# Altium schematic sheet analog_adc.SchDoc
size A3
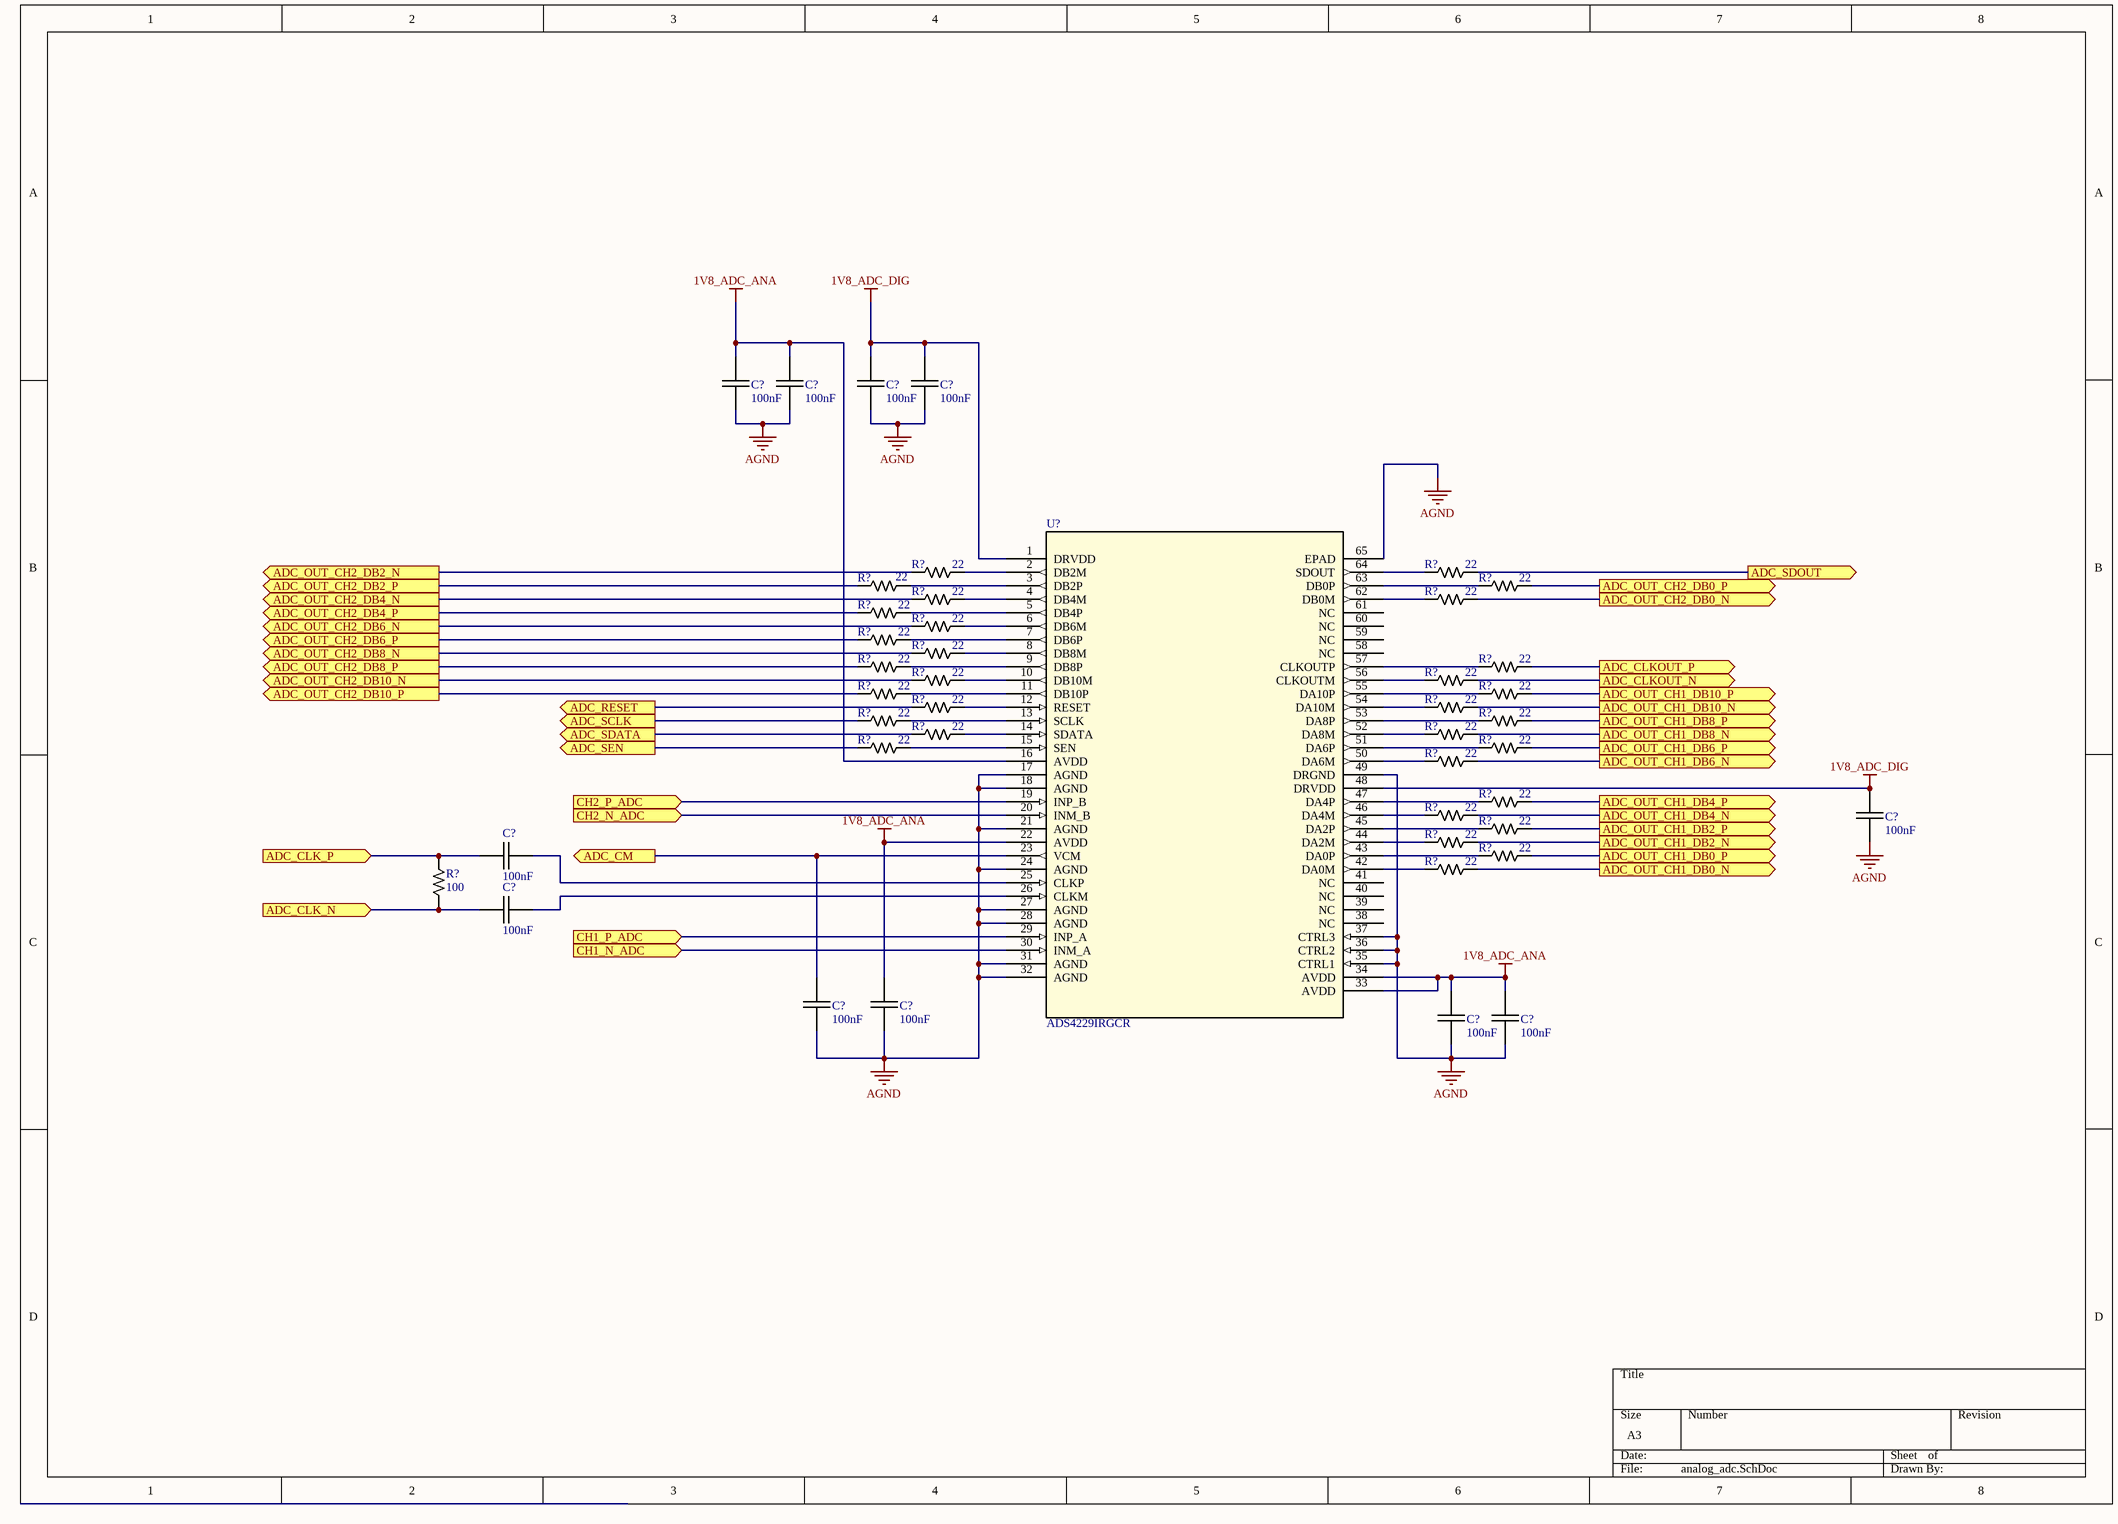
[diagram p0: analog_adc.SchDoc]

## Parts
(Parts that share a designator on the sheet are numbered #1, #2 ... from top to bottom, then left to right.)
C?#1  value 100nF  [CAPC1005X06N]  (hidden comment: MLLC Capacitor)
C?#2  value 100nF  [CAPC1005X06N]  (hidden comment: MLLC Capacitor)
C?#3  value 100nF  [CAPC1005X06N]  (hidden comment: MLLC Capacitor)
C?#4  value 100nF  [CAPC1005X06N]  (hidden comment: MLLC Capacitor)
C?#5  value 100nF  [CAPC1005X06N]  (hidden comment: MLLC Capacitor)
C?#6  value 100nF  [CAPC1005X06N]  (hidden comment: MLLC Capacitor)
C?#7  value 100nF  [CAPC1005X06N]  (hidden comment: MLLC Capacitor)
C?#8  value 100nF  [CAPC1005X06N]  (hidden comment: MLLC Capacitor)
C?#9  value 100nF  [CAPC1005X06N]  (hidden comment: MLLC Capacitor)
C?#10  value 100nF  [CAPC1005X06N]  (hidden comment: MLLC Capacitor)
C?#11  value 100nF  [CAPC1005X06N]  (hidden comment: MLLC Capacitor)
R?#1  value 22  [RESC1005X04N]  (hidden comment: Chip Resistor)
R?#2  value 22  [RESC1005X04N]  (hidden comment: Chip Resistor)
R?#3  value 22  [RESC1005X04N]  (hidden comment: Chip Resistor)
R?#4  value 22  [RESC1005X04N]  (hidden comment: Chip Resistor)
R?#5  value 22  [RESC1005X04N]  (hidden comment: Chip Resistor)
R?#6  value 22  [RESC1005X04N]  (hidden comment: Chip Resistor)
R?#7  value 22  [RESC1005X04N]  (hidden comment: Chip Resistor)
R?#8  value 22  [RESC1005X04N]  (hidden comment: Chip Resistor)
R?#9  value 22  [RESC1005X04N]  (hidden comment: Chip Resistor)
R?#10  value 22  [RESC1005X04N]  (hidden comment: Chip Resistor)
R?#11  value 22  [RESC1005X04N]  (hidden comment: Chip Resistor)
R?#12  value 22  [RESC1005X04N]  (hidden comment: Chip Resistor)
R?#13  value 22  [RESC1005X04N]  (hidden comment: Chip Resistor)
R?#14  value 22  [RESC1005X04N]  (hidden comment: Chip Resistor)
R?#15  value 22  [RESC1005X04N]  (hidden comment: Chip Resistor)
R?#16  value 22  [RESC1005X04N]  (hidden comment: Chip Resistor)
R?#17  value 22  [RESC1005X04N]  (hidden comment: Chip Resistor)
R?#18  value 22  [RESC1005X04N]  (hidden comment: Chip Resistor)
R?#19  value 22  [RESC1005X04N]  (hidden comment: Chip Resistor)
R?#20  value 22  [RESC1005X04N]  (hidden comment: Chip Resistor)
R?#21  value 22  [RESC1005X04N]  (hidden comment: Chip Resistor)
R?#22  value 22  [RESC1005X04N]  (hidden comment: Chip Resistor)
R?#23  value 22  [RESC1005X04N]  (hidden comment: Chip Resistor)
R?#24  value 22  [RESC1005X04N]  (hidden comment: Chip Resistor)
R?#25  value 22  [RESC1005X04N]  (hidden comment: Chip Resistor)
R?#26  value 22  [RESC1005X04N]  (hidden comment: Chip Resistor)
R?#27  value 22  [RESC1005X04N]  (hidden comment: Chip Resistor)
R?#28  value 22  [RESC1005X04N]  (hidden comment: Chip Resistor)
R?#29  value 22  [RESC1005X04N]  (hidden comment: Chip Resistor)
R?#30  value 22  [RESC1005X04N]  (hidden comment: Chip Resistor)
R?#31  value 22  [RESC1005X04N]  (hidden comment: Chip Resistor)
R?#32  value 100  [RESC1005X04N]  (hidden comment: Chip Resistor)
U?  ADS4229IRGCR  [RGC64_7P4X7P4]

## Ports
ADC_CLK_N (in), ADC_CLK_P (in), ADC_CLKOUT_N (out), ADC_CLKOUT_P (out), ADC_CM (out), ADC_OUT_CH1_DB0_N (out), ADC_OUT_CH1_DB0_P (out), ADC_OUT_CH1_DB2_N (out), ADC_OUT_CH1_DB2_P (out), ADC_OUT_CH1_DB4_N (out), ADC_OUT_CH1_DB4_P (out), ADC_OUT_CH1_DB6_N (out), ADC_OUT_CH1_DB6_P (out), ADC_OUT_CH1_DB8_N (out), ADC_OUT_CH1_DB8_P (out), ADC_OUT_CH1_DB10_N (out), ADC_OUT_CH1_DB10_P (out), ADC_OUT_CH2_DB0_N (out), ADC_OUT_CH2_DB0_P (out), ADC_OUT_CH2_DB2_N (out), ADC_OUT_CH2_DB2_P (out), ADC_OUT_CH2_DB4_N (out), ADC_OUT_CH2_DB4_P (out), ADC_OUT_CH2_DB6_N (out), ADC_OUT_CH2_DB6_P (out), ADC_OUT_CH2_DB8_N (out), ADC_OUT_CH2_DB8_P (out), ADC_OUT_CH2_DB10_N (out), ADC_OUT_CH2_DB10_P (out), ADC_RESET (out), ADC_SCLK (out), ADC_SDATA (out), ADC_SDOUT (out), ADC_SEN (out), CH1_N_ADC (in), CH1_P_ADC (in), CH2_N_ADC (in), CH2_P_ADC (in)

## Nets
1V8_ADC_ANA: C?#1.1 C?#2.1 C?#9.1 C?#10.1 C?#11.1 U?.16(AVDD) U?.22(AVDD) U?.33(AVDD) U?.34(AVDD)
1V8_ADC_DIG: C?#3.1 C?#4.1 C?#5.1 U?.1(DRVDD) U?.48(DRVDD)
AGND: C?#1.2 C?#2.2 C?#3.2 C?#4.2 C?#5.2 C?#8.2 C?#9.2 C?#10.2 C?#11.2 U?.17(AGND) U?.18(AGND) U?.21(AGND) U?.24(AGND) U?.27(AGND) U?.28(AGND) U?.31(AGND) U?.32(AGND) U?.35(CTRL1) U?.36(CTRL2) U?.37(CTRL3) U?.49(DRGND) U?.65(EPAD)
ADC_CLK_N: C?#7.2 R?#32.1 ; port ADC_CLK_N
ADC_CLK_P: C?#6.2 R?#32.2 ; port ADC_CLK_P
ADC_CLKOUT_N: R?#14.1 ; port ADC_CLKOUT_N
ADC_CLKOUT_P: R?#12.1 ; port ADC_CLKOUT_P
ADC_CM: C?#8.1 U?.23(VCM) ; port ADC_CM
ADC_OUT_CH1_DB0_N: R?#31.1 ; port ADC_OUT_CH1_DB0_N
ADC_OUT_CH1_DB0_P: R?#30.1 ; port ADC_OUT_CH1_DB0_P
ADC_OUT_CH1_DB2_N: R?#29.1 ; port ADC_OUT_CH1_DB2_N
ADC_OUT_CH1_DB2_P: R?#28.1 ; port ADC_OUT_CH1_DB2_P
ADC_OUT_CH1_DB4_N: R?#27.1 ; port ADC_OUT_CH1_DB4_N
ADC_OUT_CH1_DB4_P: R?#26.1 ; port ADC_OUT_CH1_DB4_P
ADC_OUT_CH1_DB6_N: R?#25.1 ; port ADC_OUT_CH1_DB6_N
ADC_OUT_CH1_DB6_P: R?#24.1 ; port ADC_OUT_CH1_DB6_P
ADC_OUT_CH1_DB8_N: R?#22.1 ; port ADC_OUT_CH1_DB8_N
ADC_OUT_CH1_DB8_P: R?#20.1 ; port ADC_OUT_CH1_DB8_P
ADC_OUT_CH1_DB10_N: R?#18.1 ; port ADC_OUT_CH1_DB10_N
ADC_OUT_CH1_DB10_P: R?#16.1 ; port ADC_OUT_CH1_DB10_P
ADC_OUT_CH2_DB0_N: R?#6.1 ; port ADC_OUT_CH2_DB0_N
ADC_OUT_CH2_DB0_P: R?#4.1 ; port ADC_OUT_CH2_DB0_P
ADC_OUT_CH2_DB2_N: R?#1.2 ; port ADC_OUT_CH2_DB2_N
ADC_OUT_CH2_DB2_P: R?#3.2 ; port ADC_OUT_CH2_DB2_P
ADC_OUT_CH2_DB4_N: R?#5.2 ; port ADC_OUT_CH2_DB4_N
ADC_OUT_CH2_DB4_P: R?#7.2 ; port ADC_OUT_CH2_DB4_P
ADC_OUT_CH2_DB6_N: R?#8.2 ; port ADC_OUT_CH2_DB6_N
ADC_OUT_CH2_DB6_P: R?#9.2 ; port ADC_OUT_CH2_DB6_P
ADC_OUT_CH2_DB8_N: R?#10.2 ; port ADC_OUT_CH2_DB8_N
ADC_OUT_CH2_DB8_P: R?#11.2 ; port ADC_OUT_CH2_DB8_P
ADC_OUT_CH2_DB10_N: R?#13.2 ; port ADC_OUT_CH2_DB10_N
ADC_OUT_CH2_DB10_P: R?#15.2 ; port ADC_OUT_CH2_DB10_P
ADC_RESET: R?#17.2 ; port ADC_RESET
ADC_SCLK: R?#19.2 ; port ADC_SCLK
ADC_SDATA: R?#21.2 ; port ADC_SDATA
ADC_SDOUT: R?#2.1 ; port ADC_SDOUT
ADC_SEN: R?#23.2 ; port ADC_SEN
CH1_N_ADC: U?.30(INM_A) ; port CH1_N_ADC
CH1_P_ADC: U?.29(INP_A) ; port CH1_P_ADC
CH2_N_ADC: U?.20(INM_B) ; port CH2_N_ADC
CH2_P_ADC: U?.19(INP_B) ; port CH2_P_ADC
NetC?#6_1: C?#6.1 U?.25(CLKP)
NetC?#7_1: C?#7.1 U?.26(CLKM)
NetR?#1_1: R?#1.1 U?.2(DB2M)
NetR?#2_2: R?#2.2 U?.64(SDOUT)
NetR?#3_1: R?#3.1 U?.3(DB2P)
NetR?#4_2: R?#4.2 U?.63(DB0P)
NetR?#5_1: R?#5.1 U?.4(DB4M)
NetR?#6_2: R?#6.2 U?.62(DB0M)
NetR?#7_1: R?#7.1 U?.5(DB4P)
NetR?#8_1: R?#8.1 U?.6(DB6M)
NetR?#9_1: R?#9.1 U?.7(DB6P)
NetR?#10_1: R?#10.1 U?.8(DB8M)
NetR?#11_1: R?#11.1 U?.9(DB8P)
NetR?#12_2: R?#12.2 U?.57(CLKOUTP)
NetR?#13_1: R?#13.1 U?.10(DB10M)
NetR?#14_2: R?#14.2 U?.56(CLKOUTM)
NetR?#15_1: R?#15.1 U?.11(DB10P)
NetR?#16_2: R?#16.2 U?.55(DA10P)
NetR?#17_1: R?#17.1 U?.12(RESET)
NetR?#18_2: R?#18.2 U?.54(DA10M)
NetR?#19_1: R?#19.1 U?.13(SCLK)
NetR?#20_2: R?#20.2 U?.53(DA8P)
NetR?#21_1: R?#21.1 U?.14(SDATA)
NetR?#22_2: R?#22.2 U?.52(DA8M)
NetR?#23_1: R?#23.1 U?.15(SEN)
NetR?#24_2: R?#24.2 U?.51(DA6P)
NetR?#25_2: R?#25.2 U?.50(DA6M)
NetR?#26_2: R?#26.2 U?.47(DA4P)
NetR?#27_2: R?#27.2 U?.46(DA4M)
NetR?#28_2: R?#28.2 U?.45(DA2P)
NetR?#29_2: R?#29.2 U?.44(DA2M)
NetR?#30_2: R?#30.2 U?.43(DA0P)
NetR?#31_2: R?#31.2 U?.42(DA0M)

Not connected (* = marked no-connect by the designer): U? 38(NC) 39(NC) 40(NC) 41(NC) 58(NC) 59(NC) 60(NC) 61(NC)

## Library data of the parts
C?#1-C?#11 = Cap: Rating: *
R?#1-R?#32 = Res
U? = ADS4229IRGCR: 12-Bit 250MSPS Dual Low Power ADC; Manufacturer: Texas Instruments; INDUSTRY_STD_PKG_TYPE: VQFN; FAMILY_NAME: HIGH SPEED ADC (>10MSPS); PIN_COUNT: 64; PACKAGE_DESIGNATOR: RGC; Datasheet_URL: http://www.ti.com/lit/gpn/ADS4229; GENERIC_PART_NUMBER: ADS4229; Copyright: Copyright (C) 2018 Accelerated Designs. All rights reserved; RefDes: RefDes; Type: DEV; ComponentLink1Description: Product Page; ComponentLink1URL: https://www.ti.com/product/ADS4229